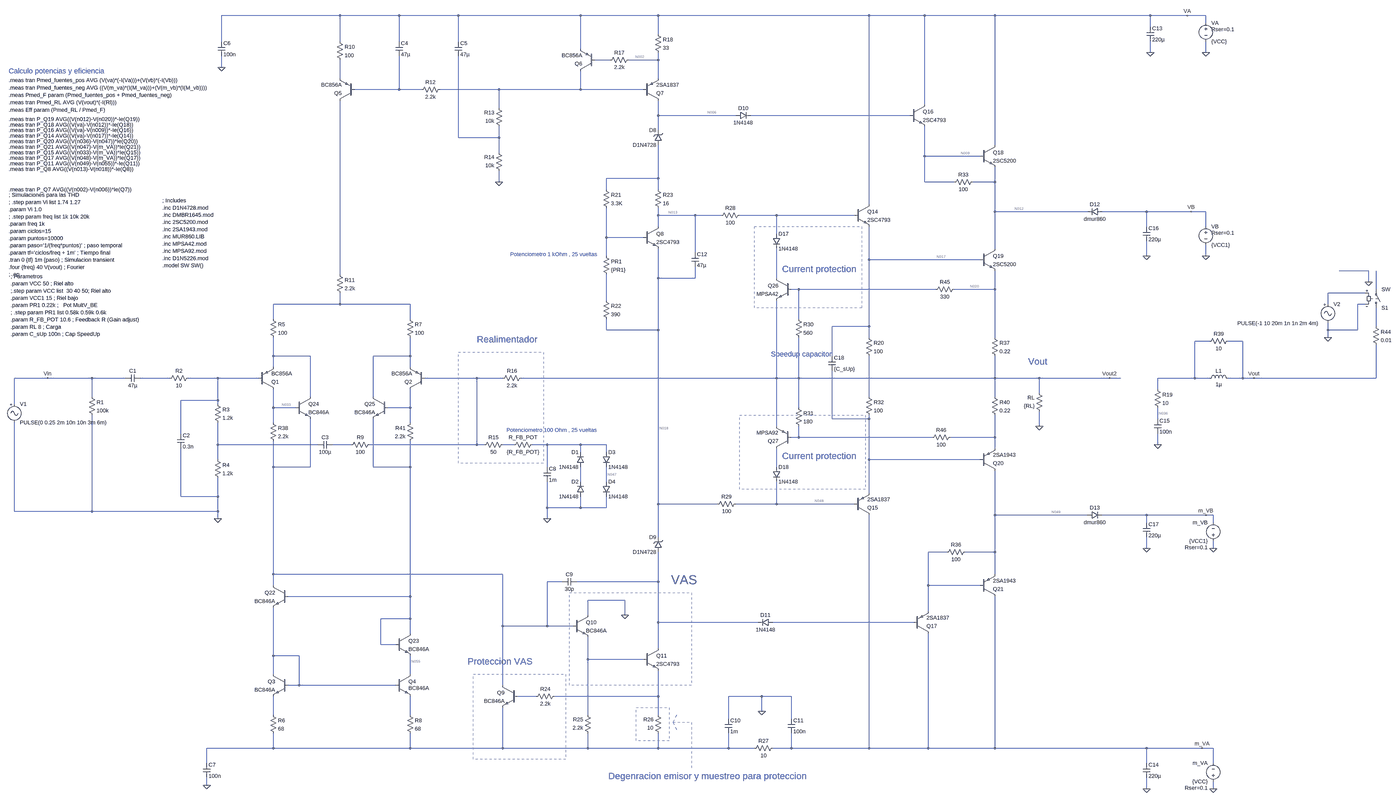
[diagram p0: schematic ClassG_v3_slewRate.asc, whole sheet]
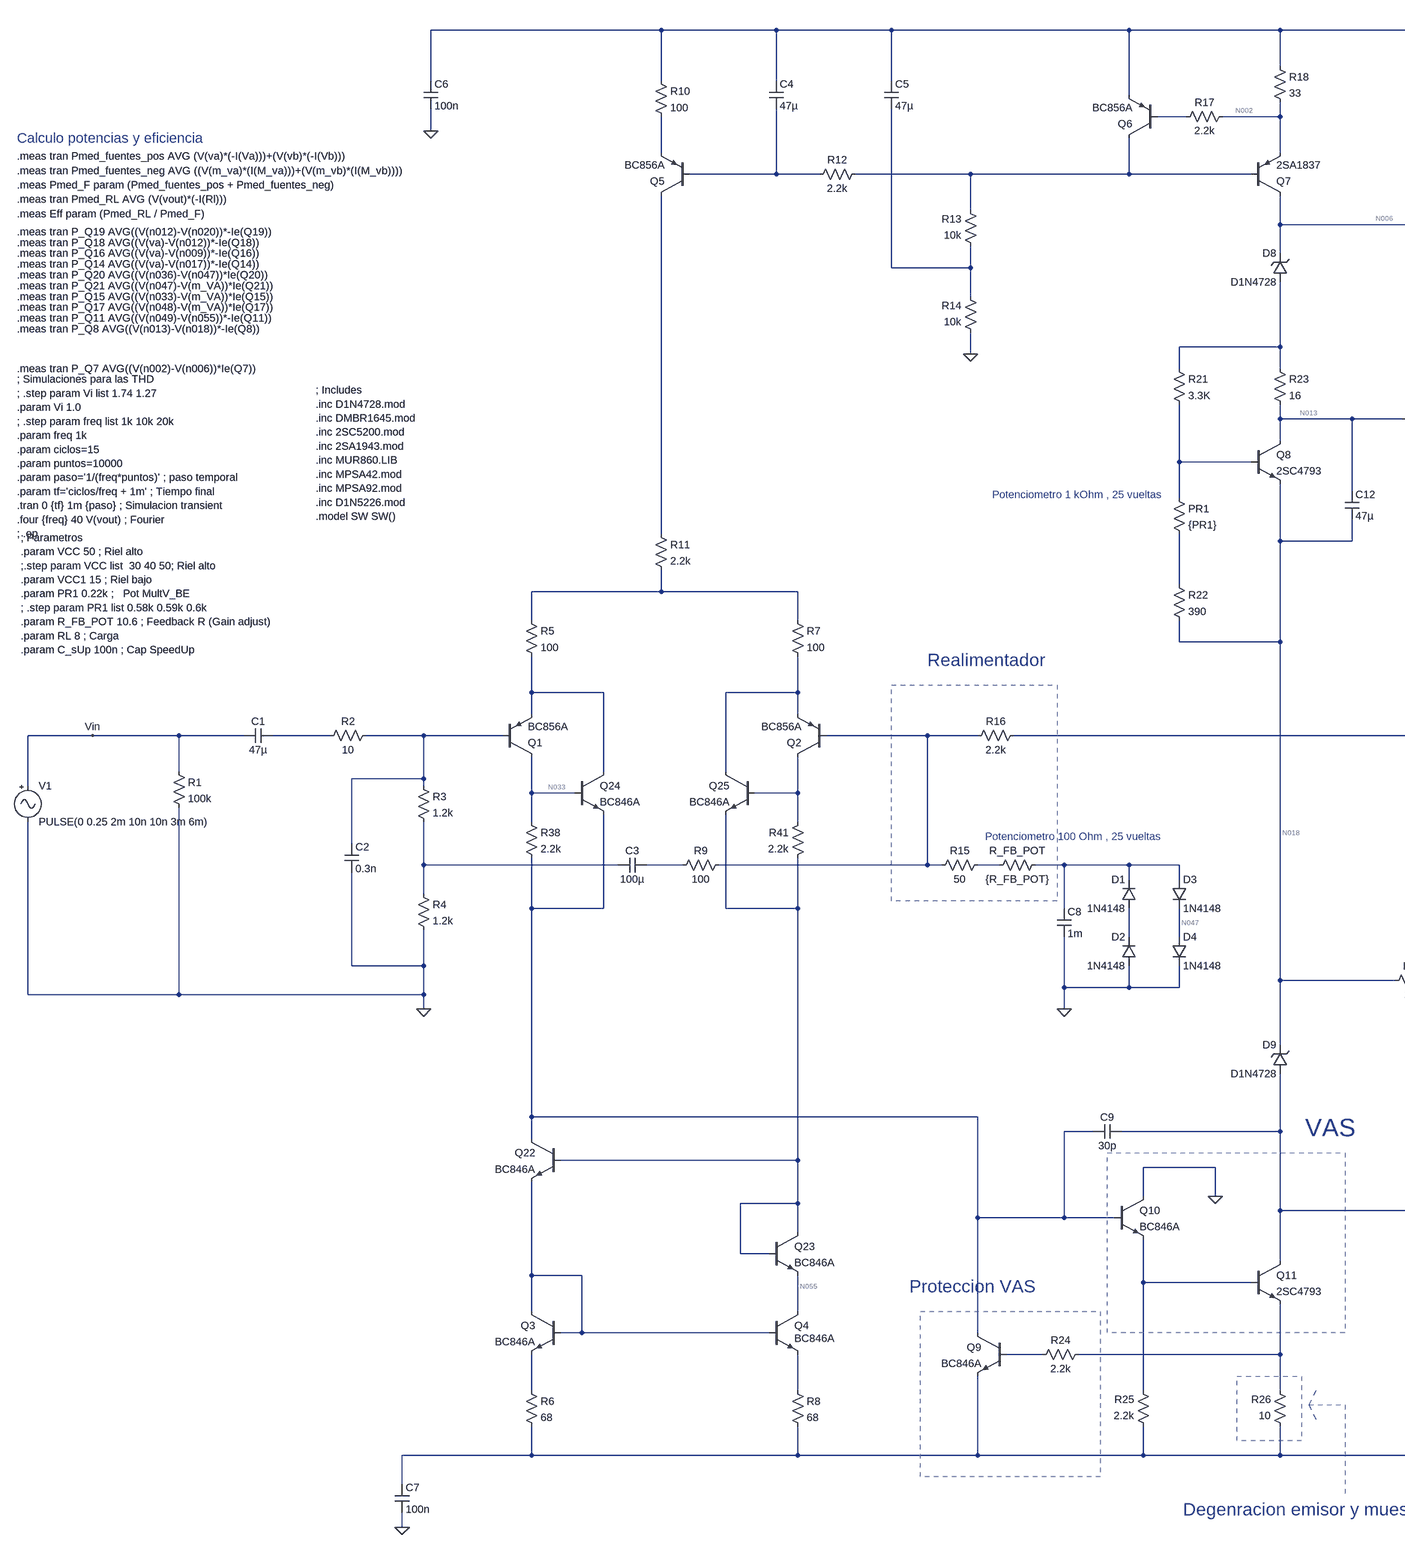
[diagram p1: schematic ClassG_v3_slewRate.asc, part, row 1 of 1, column 1 of 2]
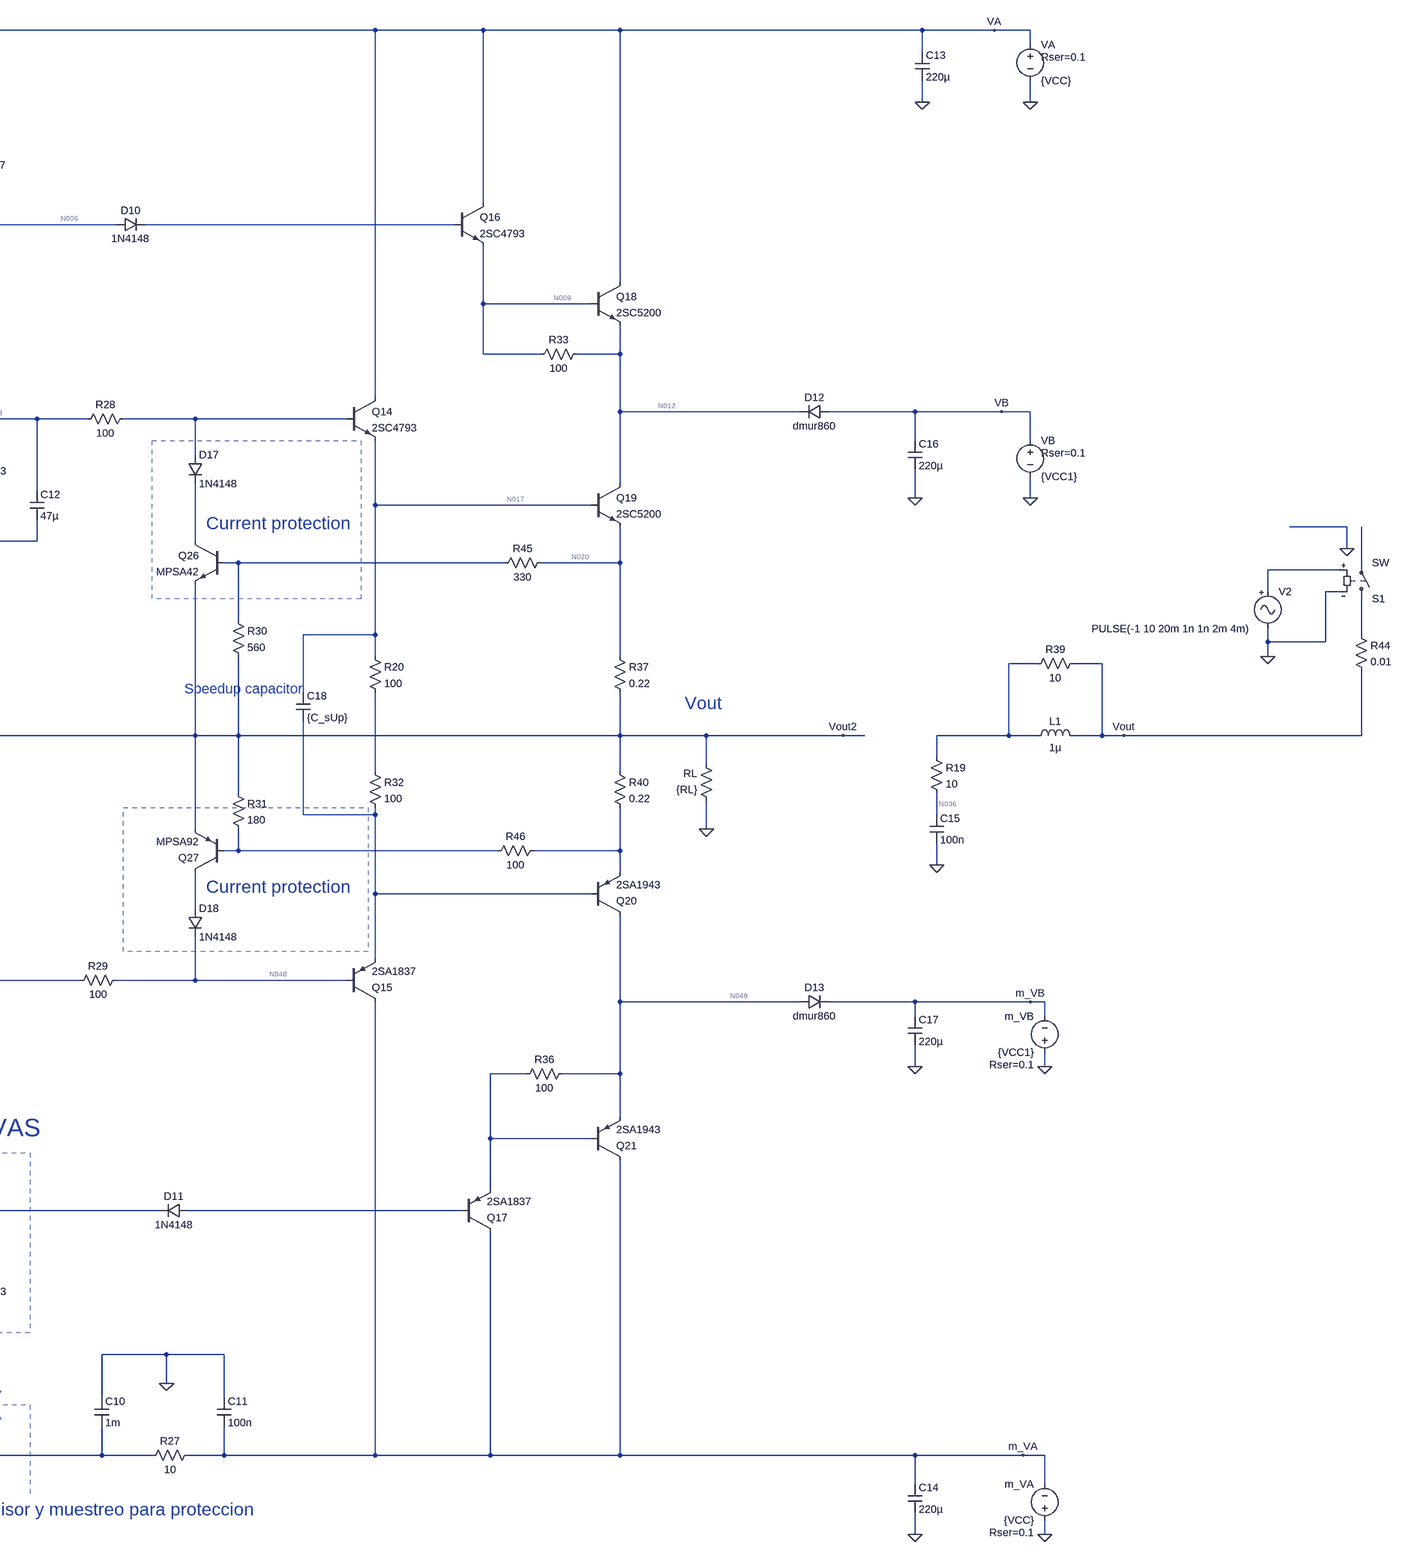
[diagram p2: schematic ClassG_v3_slewRate.asc, part, row 1 of 1, column 2 of 2]
ClassG_v3_slewRate.asc, the LTspice schematic file:
Version 4
SHEET 1 5612 1844
WIRE 1056 -1520 544 -1520
WIRE 1312 -1520 1056 -1520
WIRE 1568 -1520 1312 -1520
WIRE 2096 -1520 1568 -1520
WIRE 2432 -1520 2096 -1520
WIRE 3344 -1520 2432 -1520
WIRE 3584 -1520 3344 -1520
WIRE 3888 -1520 3584 -1520
WIRE 4560 -1520 3888 -1520
WIRE 4720 -1520 4560 -1520
WIRE 4800 -1520 4720 -1520
WIRE 4800 -1488 4800 -1520
WIRE 4560 -1472 4560 -1520
WIRE 2432 -1440 2432 -1520
WIRE 544 -1408 544 -1520
WIRE 1056 -1408 1056 -1520
WIRE 1312 -1408 1312 -1520
WIRE 1568 -1408 1568 -1520
WIRE 2096 -1376 2096 -1520
WIRE 4560 -1360 4560 -1408
WIRE 4800 -1360 4800 -1408
WIRE 2192 -1328 2160 -1328
WIRE 2224 -1328 2192 -1328
WIRE 2400 -1328 2304 -1328
WIRE 2432 -1328 2432 -1360
WIRE 2432 -1328 2400 -1328
WIRE 544 -1296 544 -1344
WIRE 1056 -1296 1056 -1328
WIRE 1056 -1248 1056 -1296
WIRE 2432 -1248 2432 -1328
WIRE 1216 -1200 1120 -1200
WIRE 1312 -1200 1312 -1344
WIRE 1312 -1200 1216 -1200
WIRE 1408 -1200 1312 -1200
WIRE 1744 -1200 1488 -1200
WIRE 1872 -1200 1744 -1200
WIRE 2096 -1200 2096 -1280
WIRE 2096 -1200 1872 -1200
WIRE 2368 -1200 2096 -1200
WIRE 3584 -1136 3584 -1520
WIRE 1744 -1120 1744 -1200
WIRE 2432 -1088 2432 -1152
WIRE 2560 -1088 2432 -1088
WIRE 2768 -1088 2560 -1088
WIRE 3024 -1088 2832 -1088
WIRE 3520 -1088 3024 -1088
WIRE 2432 -1024 2432 -1088
WIRE 1568 -992 1568 -1344
WIRE 1632 -992 1568 -992
WIRE 1744 -992 1744 -1040
WIRE 1744 -992 1632 -992
WIRE 3888 -960 3888 -1520
WIRE 1744 -928 1744 -992
WIRE 3584 -912 3584 -1040
WIRE 3696 -912 3584 -912
WIRE 3824 -912 3696 -912
WIRE 2432 -880 2432 -960
WIRE 1056 -864 1056 -1152
WIRE 2432 -816 2432 -880
WIRE 2432 -816 2208 -816
WIRE 1744 -800 1744 -848
WIRE 3584 -800 3584 -912
WIRE 3712 -800 3584 -800
WIRE 3888 -800 3888 -864
WIRE 3888 -800 3792 -800
WIRE 2208 -768 2208 -816
WIRE 2432 -768 2432 -816
WIRE 3344 -704 3344 -1520
WIRE 3888 -672 3888 -800
WIRE 4096 -672 3888 -672
WIRE 4288 -672 4096 -672
WIRE 4544 -672 4352 -672
WIRE 4736 -672 4544 -672
WIRE 4800 -672 4736 -672
WIRE 2432 -656 2432 -688
WIRE 2560 -656 2432 -656
WIRE 2592 -656 2560 -656
WIRE 2704 -656 2592 -656
WIRE 2944 -656 2784 -656
WIRE 3024 -656 2944 -656
WIRE 3280 -656 3024 -656
WIRE 2432 -608 2432 -656
WIRE 4544 -608 4544 -672
WIRE 4800 -608 4800 -672
WIRE 2944 -576 2944 -656
WIRE 2208 -560 2208 -688
WIRE 2288 -560 2208 -560
WIRE 2368 -560 2288 -560
WIRE 3888 -512 3888 -672
WIRE 2592 -496 2592 -656
WIRE 2208 -480 2208 -560
WIRE 4544 -480 4544 -544
WIRE 4800 -480 4800 -528
WIRE 2944 -464 2944 -512
WIRE 3344 -464 3344 -608
WIRE 3488 -464 3344 -464
WIRE 3824 -464 3488 -464
WIRE 5504 -416 5376 -416
WIRE 1056 -400 1056 -864
WIRE 2432 -384 2432 -512
WIRE 2592 -384 2592 -432
WIRE 2592 -384 2432 -384
WIRE 2944 -384 2944 -464
WIRE 5504 -368 5504 -416
WIRE 3040 -336 3008 -336
WIRE 3632 -336 3040 -336
WIRE 3888 -336 3888 -416
WIRE 3888 -336 3712 -336
WIRE 5536 -336 5536 -416
WIRE 5488 -320 5328 -320
WIRE 2208 -288 2208 -400
WIRE 1056 -272 1056 -320
WIRE 1056 -272 768 -272
WIRE 1200 -272 1056 -272
WIRE 1360 -272 1200 -272
WIRE 5328 -272 5328 -320
WIRE 5488 -272 5456 -272
WIRE 3888 -256 3888 -336
WIRE 768 -208 768 -272
WIRE 1360 -208 1360 -272
WIRE 3040 -208 3040 -336
WIRE 3344 -176 3344 -464
WIRE 3344 -176 3184 -176
WIRE 5536 -176 5536 -256
WIRE 2208 -160 2208 -208
WIRE 2432 -160 2432 -384
WIRE 2432 -160 2208 -160
WIRE 5328 -160 5328 -192
WIRE 5456 -160 5456 -272
WIRE 5456 -160 5328 -160
WIRE 3344 -128 3344 -176
WIRE 3888 -128 3888 -256
WIRE 5328 -128 5328 -160
WIRE 4816 -112 4752 -112
WIRE 4960 -112 4896 -112
WIRE 2432 -64 2432 -160
WIRE 768 -48 768 -128
WIRE 864 -48 768 -48
WIRE 928 -48 864 -48
WIRE 1280 -48 1200 -48
WIRE 1360 -48 1360 -128
WIRE 1360 -48 1280 -48
WIRE 3184 -48 3184 -176
WIRE 768 0 768 -48
WIRE 1360 0 1360 -48
WIRE 3344 0 3344 -48
WIRE -208 48 -352 48
WIRE -80 48 -208 48
WIRE -16 48 -80 48
WIRE 128 48 -16 48
WIRE 320 48 192 48
WIRE 528 48 400 48
WIRE 544 48 528 48
WIRE 704 48 544 48
WIRE 1648 48 1424 48
WIRE 1760 48 1648 48
WIRE 2944 48 2944 -288
WIRE 2944 48 1840 48
WIRE 3040 48 3040 -128
WIRE 3040 48 2944 48
WIRE 3888 48 3888 -48
WIRE 3888 48 3040 48
WIRE 4016 48 3888 48
WIRE 4064 48 4016 48
WIRE 4080 48 4064 48
WIRE 4384 48 4080 48
WIRE 4432 48 4384 48
WIRE 4752 48 4752 -112
WIRE 4752 48 4592 48
WIRE 4816 48 4752 48
WIRE 4960 48 4960 -112
WIRE 4960 48 4896 48
WIRE 5008 48 4960 48
WIRE 5536 48 5536 -96
WIRE 5536 48 5008 48
WIRE 4592 96 4592 48
WIRE 4080 112 4080 48
WIRE -16 128 -16 48
WIRE 928 128 928 -48
WIRE 1200 128 1200 -48
WIRE 3344 128 3344 0
WIRE 3888 128 3888 48
WIRE 528 144 528 48
WIRE 528 144 368 144
WIRE -352 160 -352 48
WIRE 528 160 528 144
WIRE 768 176 768 96
WIRE 784 176 768 176
WIRE 864 176 784 176
WIRE 1328 176 1264 176
WIRE 1360 176 1360 96
WIRE 1360 176 1328 176
WIRE 3040 176 3040 48
WIRE 3184 224 3184 16
WIRE 3344 224 3344 208
WIRE 3344 224 3184 224
WIRE 4592 224 4592 176
WIRE 768 240 768 176
WIRE 1360 240 1360 176
WIRE 2944 256 2944 48
WIRE 4080 256 4080 192
WIRE 368 288 368 144
WIRE 3040 304 3040 256
WIRE 3040 304 3008 304
WIRE 3616 304 3040 304
WIRE 3888 304 3888 208
WIRE 3888 304 3696 304
WIRE 528 336 528 240
WIRE 624 336 528 336
WIRE 960 336 624 336
WIRE 1104 336 1024 336
WIRE 1552 336 1184 336
WIRE 1648 336 1648 48
WIRE 1648 336 1552 336
WIRE 1680 336 1648 336
WIRE 1808 336 1760 336
WIRE 1952 336 1888 336
WIRE 2096 336 1952 336
WIRE 2208 336 2096 336
WIRE 4592 336 4592 288
WIRE 3888 352 3888 304
WIRE 2096 368 2096 336
WIRE 2208 368 2208 336
WIRE 2944 384 2944 352
WIRE 528 400 528 336
WIRE 3344 400 3344 224
WIRE 3472 400 3344 400
WIRE 3824 400 3472 400
WIRE 768 432 768 320
WIRE 928 432 928 224
WIRE 928 432 768 432
WIRE 1200 432 1200 224
WIRE 1360 432 1360 320
WIRE 1360 432 1200 432
WIRE 1952 432 1952 336
WIRE 2944 432 2944 384
WIRE 2096 496 2096 432
WIRE 2208 496 2208 432
WIRE 3344 544 3344 400
WIRE 368 560 368 352
WIRE 528 560 528 480
WIRE 528 560 368 560
WIRE 2432 592 2432 -64
WIRE 2688 592 2432 592
WIRE 2944 592 2944 496
WIRE 2944 592 2768 592
WIRE 2976 592 2944 592
WIRE 3280 592 2976 592
WIRE 1952 608 1952 496
WIRE 2096 608 2096 560
WIRE 2096 608 1952 608
WIRE 2208 608 2208 560
WIRE 2208 608 2096 608
WIRE -352 624 -352 240
WIRE -16 624 -16 208
WIRE -16 624 -352 624
WIRE 528 624 528 560
WIRE 528 624 -16 624
WIRE 3888 640 3888 448
WIRE 4016 640 3888 640
WIRE 4288 640 4016 640
WIRE 4544 640 4352 640
WIRE 4800 640 4544 640
WIRE 4832 640 4800 640
WIRE 528 656 528 624
WIRE 1952 656 1952 608
WIRE 4544 672 4544 640
WIRE 4832 672 4832 640
WIRE 2432 736 2432 592
WIRE 4544 784 4544 736
WIRE 4832 784 4832 752
WIRE 1360 800 1360 432
WIRE 3680 800 3600 800
WIRE 3888 800 3888 640
WIRE 3888 800 3760 800
WIRE 768 816 768 432
WIRE 768 896 768 816
WIRE 1760 896 768 896
WIRE 3888 896 3888 800
WIRE 2016 928 1952 928
WIRE 2432 928 2432 800
WIRE 2432 928 2080 928
WIRE 768 944 768 896
WIRE 3600 944 3600 800
WIRE 3680 944 3600 944
WIRE 3824 944 3680 944
WIRE 1360 992 1360 800
WIRE 1360 992 832 992
WIRE 2288 1008 2128 1008
WIRE 3600 1056 3600 944
WIRE 2128 1072 2128 1008
WIRE 2288 1072 2288 1008
WIRE 1360 1088 1360 992
WIRE 1360 1088 1232 1088
WIRE 2432 1104 2432 928
WIRE 2592 1104 2432 1104
WIRE 2864 1104 2592 1104
WIRE 3200 1104 2928 1104
WIRE 3536 1104 3200 1104
WIRE 1760 1120 1760 896
WIRE 1872 1120 1760 1120
WIRE 1952 1120 1952 928
WIRE 1952 1120 1872 1120
WIRE 2064 1120 1952 1120
WIRE 1360 1152 1360 1088
WIRE 1232 1200 1232 1088
WIRE 1296 1200 1232 1200
WIRE 2432 1216 2432 1104
WIRE 768 1232 768 1040
WIRE 768 1248 768 1232
WIRE 880 1248 768 1248
WIRE 2128 1264 2128 1168
WIRE 2208 1264 2128 1264
WIRE 2368 1264 2208 1264
WIRE 1360 1296 1360 1248
WIRE 768 1328 768 1248
WIRE 1360 1328 1360 1296
WIRE 880 1376 880 1248
WIRE 880 1376 832 1376
WIRE 1296 1376 880 1376
WIRE 1760 1376 1760 1120
WIRE 1856 1424 1824 1424
WIRE 1904 1424 1856 1424
WIRE 2256 1424 1984 1424
WIRE 2432 1424 2432 1312
WIRE 2432 1424 2256 1424
WIRE 2880 1424 2736 1424
WIRE 3008 1424 2880 1424
WIRE 768 1456 768 1424
WIRE 1360 1472 1360 1424
WIRE 2880 1488 2880 1424
WIRE 768 1504 768 1456
WIRE 1360 1504 1360 1472
WIRE 2128 1504 2128 1264
WIRE 2432 1504 2432 1424
WIRE 2736 1520 2736 1424
WIRE 3008 1520 3008 1424
WIRE 768 1648 768 1584
WIRE 768 1648 480 1648
WIRE 1360 1648 1360 1584
WIRE 1360 1648 768 1648
WIRE 1488 1648 1360 1648
WIRE 1760 1648 1760 1472
WIRE 1760 1648 1488 1648
WIRE 2128 1648 2128 1584
WIRE 2128 1648 1760 1648
WIRE 2432 1648 2432 1584
WIRE 2432 1648 2128 1648
WIRE 2736 1648 2736 1584
WIRE 2736 1648 2432 1648
WIRE 2848 1648 2736 1648
WIRE 3008 1648 3008 1584
WIRE 3008 1648 2928 1648
WIRE 3344 1648 3344 640
WIRE 3344 1648 3008 1648
WIRE 3600 1648 3600 1152
WIRE 3600 1648 3344 1648
WIRE 3888 1648 3888 992
WIRE 3888 1648 3600 1648
WIRE 4544 1648 3888 1648
WIRE 4784 1648 4544 1648
WIRE 4832 1648 4784 1648
WIRE 480 1712 480 1648
WIRE 4544 1712 4544 1648
WIRE 4832 1712 4832 1648
WIRE 480 1808 480 1776
WIRE 4544 1824 4544 1776
WIRE 4832 1824 4832 1792
FLAG 528 656 0
FLAG 1952 656 0
FLAG 2880 1488 0
FLAG 2288 1072 0
FLAG 4544 784 0
FLAG 4544 1824 0
FLAG 4832 1824 0
FLAG 4832 784 0
FLAG 1744 -800 0
FLAG 544 -1296 0
FLAG 4560 -1360 0
FLAG 4800 -1360 0
FLAG 4800 -480 0
FLAG 4544 -480 0
FLAG 4592 336 0
FLAG 4080 256 0
FLAG 480 1808 0
FLAG 5008 48 Vout
FLAG -208 48 Vin
FLAG 4384 48 Vout2
FLAG 5328 -128 0
FLAG 5504 -368 0
FLAG 4800 640 m_VB
FLAG 4736 -672 VB
FLAG 4720 -1520 VA
FLAG 4784 1648 m_VA
DATAFLAG 4016 48 ""
DATAFLAG 4064 48 ""
DATAFLAG 4016 640 ""
DATAFLAG 1552 336 ""
DATAFLAG 768 816 ""
DATAFLAG 1360 800 ""
DATAFLAG 544 48 ""
DATAFLAG 2256 1424 ""
DATAFLAG 2208 1264 ""
DATAFLAG 2432 -64 ""
DATAFLAG 2432 -880 ""
DATAFLAG 3024 -656 ""
DATAFLAG 3488 -464 ""
DATAFLAG 3472 400 ""
DATAFLAG 3680 944 ""
DATAFLAG 3696 -912 ""
DATAFLAG 1872 -1200 ""
DATAFLAG 1200 -272 ""
DATAFLAG 1056 -864 ""
DATAFLAG 624 336 ""
DATAFLAG -80 48 ""
DATAFLAG 2976 592 ""
DATAFLAG 3024 -1088 ""
DATAFLAG 2400 -1328 ""
DATAFLAG 1216 -1200 ""
DATAFLAG 1632 -992 ""
DATAFLAG 768 1232 ""
DATAFLAG 1856 1424 ""
DATAFLAG 1360 1296 ""
DATAFLAG 1328 176 ""
DATAFLAG 784 176 ""
DATAFLAG 864 -48 ""
DATAFLAG 1280 -48 ""
DATAFLAG 2944 -464 ""
DATAFLAG 3040 -336 ""
DATAFLAG 3040 304 ""
DATAFLAG 2944 384 ""
DATAFLAG 3888 -256 ""
DATAFLAG 3888 304 ""
DATAFLAG 2592 1104 ""
DATAFLAG 1360 1472 ""
DATAFLAG 768 1456 ""
DATAFLAG 3200 1104 ""
DATAFLAG 3344 0 ""
DATAFLAG 2288 -560 ""
DATAFLAG 2560 -656 ""
DATAFLAG 2560 -1088 ""
DATAFLAG 2192 -1328 ""
DATAFLAG 1056 -1296 ""
DATAFLAG 4096 -672 ""
DATAFLAG 1872 1120 ""
DATAFLAG 1488 1648 ""
SYMBOL res -32 112 R0
SYMATTR InstName R1
SYMATTR Value 100k
SYMBOL res 416 32 R90
WINDOW 0 0 56 VBottom 2
WINDOW 3 32 56 VTop 2
SYMATTR InstName R2
SYMATTR Value 10
SYMBOL cap 192 32 R90
WINDOW 0 0 32 VBottom 2
WINDOW 3 32 32 VTop 2
SYMATTR InstName C1
SYMATTR Value 47µ
SYMBOL res 512 144 R0
SYMATTR InstName R3
SYMATTR Value 1.2k
SYMBOL res 512 384 R0
SYMATTR InstName R4
SYMATTR Value 1.2k
SYMBOL cap 352 288 R0
SYMATTR InstName C2
SYMATTR Value 0.3n
SYMBOL res 752 -224 R0
SYMATTR InstName R5
SYMATTR Value 100
SYMBOL res 1344 -224 R0
SYMATTR InstName R7
SYMATTR Value 100
SYMBOL res 1040 -416 R0
SYMATTR InstName R11
SYMATTR Value 2.2k
SYMBOL res 1856 32 R90
WINDOW 0 0 56 VBottom 2
WINDOW 3 32 56 VTop 2
SYMATTR InstName R16
SYMATTR Value 2.2k
SYMBOL res 1200 320 R90
WINDOW 0 0 56 VBottom 2
WINDOW 3 32 56 VTop 2
SYMATTR InstName R9
SYMATTR Value 100
SYMBOL cap 1024 320 R90
WINDOW 0 0 32 VBottom 2
WINDOW 3 32 32 VTop 2
SYMATTR InstName C3
SYMATTR Value 100µ
SYMBOL res 1776 320 R90
WINDOW 0 0 56 VBottom 2
WINDOW 3 32 56 VTop 2
SYMATTR InstName R15
SYMATTR Value 50
SYMBOL cap 1936 432 R0
SYMATTR InstName C8
SYMATTR Value 1m
SYMBOL diode 2112 432 R180
WINDOW 0 24 64 Left 2
WINDOW 3 24 0 Left 2
SYMATTR InstName D1
SYMATTR Value 1N4148
SYMBOL diode 2192 368 R0
SYMATTR InstName D3
SYMATTR Value 1N4148
SYMBOL diode 2192 496 R0
SYMATTR InstName D4
SYMATTR Value 1N4148
SYMBOL diode 2112 560 R180
WINDOW 0 24 64 Left 2
WINDOW 3 24 0 Left 2
SYMATTR InstName D2
SYMATTR Value 1N4148
SYMBOL Misc\\signal -352 144 R0
WINDOW 123 0 0 Left 2
WINDOW 39 0 0 Left 2
SYMATTR InstName V1
SYMATTR Value PULSE(0 0.25 2m 10n 10n 3m 6m)
SYMBOL npn 832 1328 M0
SYMATTR InstName Q3
SYMATTR Value BC846A
SYMBOL npn 1296 1328 R0
WINDOW 3 56 60 Left 2
SYMATTR Value BC846A
SYMATTR InstName Q4
SYMBOL res 752 1488 R0
SYMATTR InstName R6
SYMATTR Value 68
SYMBOL res 1344 1488 R0
SYMATTR InstName R8
SYMATTR Value 68
SYMBOL npn 1824 1376 M0
SYMATTR InstName Q9
SYMATTR Value BC846A
SYMBOL npn 2064 1072 R0
SYMATTR InstName Q10
SYMATTR Value BC846A
SYMBOL npn 2368 1216 R0
SYMATTR InstName Q11
SYMATTR Value 2SC4793
SYMBOL res 2000 1408 R90
WINDOW 0 0 56 VBottom 2
WINDOW 3 32 56 VTop 2
SYMATTR InstName R24
SYMATTR Value 2.2k
SYMBOL res 2144 1600 R180
WINDOW 0 36 76 Left 2
WINDOW 3 36 40 Left 2
SYMATTR InstName R25
SYMATTR Value 2.2k
SYMBOL res 2448 1600 R180
WINDOW 0 36 76 Left 2
WINDOW 3 36 40 Left 2
SYMATTR InstName R26
SYMATTR Value 10
SYMBOL cap 2080 912 R90
WINDOW 0 0 32 VBottom 2
WINDOW 3 32 32 VTop 2
SYMATTR InstName C9
SYMATTR Value 30p
SYMBOL cap 2720 1520 R0
SYMATTR InstName C10
SYMATTR Value 1m
SYMBOL cap 2992 1520 R0
SYMATTR InstName C11
SYMATTR Value 100n
SYMBOL res 2944 1632 R90
WINDOW 0 0 56 VBottom 2
WINDOW 3 32 56 VTop 2
SYMATTR InstName R27
SYMATTR Value 10
SYMBOL res 2784 576 R90
WINDOW 0 0 56 VBottom 2
WINDOW 3 32 56 VTop 2
SYMATTR InstName R29
SYMATTR Value 100
SYMBOL pnp 3280 640 M180
SYMATTR InstName Q15
SYMATTR Value 2SA1837
SYMBOL pnp 3824 448 M180
SYMATTR InstName Q20
SYMATTR Value 2SA1943
SYMBOL res 3872 112 R0
SYMATTR InstName R40
SYMATTR Value 0.22
SYMBOL res 3328 112 R0
SYMATTR InstName R32
SYMATTR Value 100
SYMBOL zener 2448 800 R180
WINDOW 0 24 64 Left 2
WINDOW 3 24 0 Left 2
SYMATTR InstName D9
SYMATTR Value D1N4728
SYMBOL pnp 3824 992 M180
SYMATTR InstName Q21
SYMATTR Value 2SA1943
SYMBOL pnp 3536 1152 M180
SYMATTR InstName Q17
SYMATTR Value 2SA1837
SYMBOL res 3776 784 R90
WINDOW 0 0 56 VBottom 2
WINDOW 3 32 56 VTop 2
SYMATTR InstName R36
SYMATTR Value 100
SYMBOL diode 2928 1088 R90
WINDOW 0 0 32 VBottom 2
WINDOW 3 32 32 VTop 2
SYMATTR InstName D11
SYMATTR Value 1N4148
SYMBOL diode 4288 656 R270
WINDOW 0 32 32 VTop 2
WINDOW 3 0 32 VBottom 2
SYMATTR InstName D13
SYMATTR Value dmur860
SYMBOL cap 4528 672 R0
SYMATTR InstName C17
SYMATTR Value 220µ
SYMBOL cap 4528 1712 R0
SYMATTR InstName C14
SYMATTR Value 220µ
SYMBOL voltage 4832 768 R180
WINDOW 0 24 96 Left 2
WINDOW 3 24 16 Left 2
WINDOW 123 0 0 Left 2
WINDOW 39 24 -12 Left 2
SYMATTR InstName m_VB
SYMATTR Value {VCC1}
SYMATTR SpiceLine Rser=0.1
SYMBOL voltage 4832 1808 R180
WINDOW 0 24 96 Left 2
WINDOW 3 24 16 Left 2
WINDOW 123 0 0 Left 2
WINDOW 39 24 -12 Left 2
SYMATTR InstName m_VA
SYMATTR Value {VCC}
SYMATTR SpiceLine Rser=0.1
SYMBOL pnp 1120 -1152 R180
SYMATTR InstName Q5
SYMATTR Value BC856A
SYMBOL res 1040 -1424 R0
SYMATTR InstName R10
SYMATTR Value 100
SYMBOL cap 528 -1408 R0
SYMATTR InstName C6
SYMATTR Value 100n
SYMBOL cap 1296 -1408 R0
SYMATTR InstName C4
SYMATTR Value 47µ
SYMBOL cap 1552 -1408 R0
SYMATTR InstName C5
SYMATTR Value 47µ
SYMBOL res 1504 -1216 R90
WINDOW 0 0 56 VBottom 2
WINDOW 3 32 56 VTop 2
SYMATTR InstName R12
SYMATTR Value 2.2k
SYMBOL res 1760 -1024 R180
WINDOW 0 36 76 Left 2
WINDOW 3 36 40 Left 2
SYMATTR InstName R13
SYMATTR Value 10k
SYMBOL res 1760 -832 R180
WINDOW 0 36 76 Left 2
WINDOW 3 36 40 Left 2
SYMATTR InstName R14
SYMATTR Value 10k
SYMBOL pnp 2160 -1280 R180
SYMATTR InstName Q6
SYMATTR Value BC856A
SYMBOL pnp 2368 -1152 M180
SYMATTR InstName Q7
SYMATTR Value 2SA1837
SYMBOL res 2416 -1456 R0
SYMATTR InstName R18
SYMATTR Value 33
SYMBOL res 2320 -1344 R90
WINDOW 0 0 56 VBottom 2
WINDOW 3 32 56 VTop 2
SYMATTR InstName R17
SYMATTR Value 2.2k
SYMBOL zener 2448 -960 R180
WINDOW 0 24 64 Left 2
WINDOW 3 24 0 Left 2
SYMATTR InstName D8
SYMATTR Value D1N4728
SYMBOL res 2416 -784 R0
SYMATTR InstName R23
SYMATTR Value 16
SYMBOL res 2192 -784 R0
SYMATTR InstName R21
SYMATTR Value 3.3K
SYMBOL res 2192 -496 R0
SYMATTR InstName PR1
SYMATTR Value {PR1}
SYMBOL res 2192 -304 R0
SYMATTR InstName R22
SYMATTR Value 390
SYMBOL npn 2368 -608 R0
SYMATTR InstName Q8
SYMATTR Value 2SC4793
SYMBOL cap 2576 -496 R0
SYMATTR InstName C12
SYMATTR Value 47µ
SYMBOL res 3328 -144 R0
SYMATTR InstName R20
SYMATTR Value 100
SYMBOL res 3872 -144 R0
SYMATTR InstName R37
SYMATTR Value 0.22
SYMBOL res 2800 -672 R90
WINDOW 0 0 56 VBottom 2
WINDOW 3 32 56 VTop 2
SYMATTR InstName R28
SYMATTR Value 100
SYMBOL npn 3280 -704 R0
SYMATTR InstName Q14
SYMATTR Value 2SC4793
SYMBOL npn 3824 -512 R0
SYMATTR InstName Q19
SYMATTR Value 2SC5200
SYMBOL npn 3520 -1136 R0
SYMATTR InstName Q16
SYMATTR Value 2SC4793
SYMBOL npn 3824 -960 R0
SYMATTR InstName Q18
SYMATTR Value 2SC5200
SYMBOL diode 2768 -1072 R270
WINDOW 0 32 32 VTop 2
WINDOW 3 0 32 VBottom 2
SYMATTR InstName D10
SYMATTR Value 1N4148
SYMBOL res 3808 -816 R90
WINDOW 0 0 56 VBottom 2
WINDOW 3 32 56 VTop 2
SYMATTR InstName R33
SYMATTR Value 100
SYMBOL diode 4352 -688 R90
WINDOW 0 0 32 VBottom 2
WINDOW 3 32 32 VTop 2
SYMATTR InstName D12
SYMATTR Value dmur860
SYMBOL cap 4528 -608 R0
SYMATTR InstName C16
SYMATTR Value 220µ
SYMBOL voltage 4800 -624 R0
WINDOW 123 0 0 Left 2
WINDOW 39 24 44 Left 2
SYMATTR SpiceLine Rser=0.1
SYMATTR InstName VB
SYMATTR Value {VCC1}
SYMBOL voltage 4800 -1504 R0
WINDOW 123 0 0 Left 2
WINDOW 39 24 44 Left 2
SYMATTR SpiceLine Rser=0.1
SYMATTR InstName VA
SYMATTR Value {VCC}
SYMBOL cap 4544 -1472 R0
SYMATTR InstName C13
SYMATTR Value 220µ
SYMBOL res 4576 80 R0
SYMATTR InstName R19
SYMATTR Value 10
SYMBOL cap 4576 224 R0
SYMATTR InstName C15
SYMATTR Value 100n
SYMBOL ind 4800 64 R270
WINDOW 0 32 56 VTop 2
WINDOW 3 5 56 VBottom 2
SYMATTR InstName L1
SYMATTR Value 1µ
SYMBOL res 4912 -128 R90
WINDOW 0 0 56 VBottom 2
WINDOW 3 32 56 VTop 2
SYMATTR InstName R39
SYMATTR Value 10
SYMBOL res 4096 208 R180
WINDOW 0 36 76 Left 2
WINDOW 3 36 40 Left 2
SYMATTR InstName RL
SYMATTR Value {RL}
SYMBOL cap 464 1712 R0
SYMATTR InstName C7
SYMATTR Value 100n
SYMBOL npn 832 944 M0
SYMATTR InstName Q22
SYMATTR Value BC846A
SYMBOL npn 1296 1152 R0
SYMATTR InstName Q23
SYMATTR Value BC846A
SYMBOL pnp 704 96 M180
SYMATTR InstName Q1
SYMATTR Value BC856A
SYMBOL res 752 224 R0
SYMATTR InstName R38
SYMATTR Value 2.2k
SYMBOL pnp 1424 96 R180
SYMATTR InstName Q2
SYMATTR Value BC856A
SYMBOL res 1376 224 M0
SYMATTR InstName R41
SYMATTR Value 2.2k
SYMBOL npn 864 128 R0
SYMATTR InstName Q24
SYMATTR Value BC846A
SYMBOL npn 1264 128 M0
SYMATTR InstName Q25
SYMATTR Value BC846A
SYMBOL cap 3168 -48 R0
SYMATTR InstName C18
SYMATTR Value {C_sUp}
SYMBOL Misc\\signal 5328 -288 R0
WINDOW 3 -392 99 Left 2
WINDOW 123 0 0 Left 2
WINDOW 39 0 0 Left 2
SYMATTR Value PULSE(-1 10 20m 1n 1n 2m 4m)
SYMATTR InstName V2
SYMBOL sw 5536 -240 M180
SYMATTR InstName S1
SYMBOL res 5520 -192 R0
SYMATTR InstName R44
SYMATTR Value 0.01
SYMBOL npn 3008 -384 M0
SYMATTR InstName Q26
SYMATTR Value MPSA42
SYMBOL diode 2928 -576 R0
SYMATTR InstName D17
SYMATTR Value 1N4148
SYMBOL res 3728 -352 R90
WINDOW 0 0 56 VBottom 2
WINDOW 3 32 56 VTop 2
SYMATTR InstName R45
SYMATTR Value 330
SYMBOL pnp 3008 352 R180
SYMATTR InstName Q27
SYMATTR Value MPSA92
SYMBOL diode 2928 432 R0
SYMATTR InstName D18
SYMATTR Value 1N4148
SYMBOL res 3712 288 R90
WINDOW 0 0 56 VBottom 2
WINDOW 3 32 56 VTop 2
SYMATTR InstName R46
SYMATTR Value 100
SYMBOL res 3024 -224 R0
SYMATTR InstName R30
SYMATTR Value 560
SYMBOL res 3024 160 R0
SYMATTR InstName R31
SYMATTR Value 180
SYMBOL res 1904 320 R90
WINDOW 0 0 56 VBottom 2
WINDOW 3 32 56 VTop 2
SYMATTR InstName R_FB_POT
SYMATTR Value {R_FB_POT}
TEXT 1608 1272 Left 4 ;Proteccion VAS
TEXT 2216 1768 Left 4 ;Degenracion emisor y muestreo para proteccion
TEXT 2488 920 Left 5 ;VAS
TEXT 2920 -56 Left 3 ;Speedup capacitor
TEXT 2968 -424 Left 4 ;Current protection
TEXT 2968 384 Left 4 ;Current protection
TEXT 4032 -24 Left 4 ;Vout
TEXT -376 -1208 Left 2 !.meas tran Pmed_fuentes_neg AVG ((V(m_va)*(I(M_va)))+(V(m_vb)*(I(M_vb))))
TEXT -376 -1240 Left 2 !.meas tran Pmed_fuentes_pos AVG (V(va)*(-I(Va)))+(V(vb)*(-I(Vb)))
TEXT -376 -1176 Left 2 !.meas Pmed_F param (Pmed_fuentes_pos + Pmed_fuentes_neg)
TEXT -376 -1280 Left 3 ;Calculo potencias y eficiencia
TEXT -376 -1144 Left 2 !.meas tran Pmed_RL AVG (V(vout)*(-I(Rl)))
TEXT -376 -1112 Left 2 !.meas Eff param (Pmed_RL / Pmed_F)
TEXT -376 -744 Left 2 !; Simulaciones para las THD \n; .step param Vi list 1.74 1.27\n.param Vi 1.0\n; .step param freq list 1k 10k 20k\n.param freq 1k\n.param ciclos=15\n.param puntos=10000\n.param paso='1/(freq*puntos)' ; paso temporal\n.param tf='ciclos/freq + 1m' ; Tiempo final\n.tran 0 {tf} 1m {paso} ; Simulacion transient\n.four {freq} 40 V(vout) ; Fourier\n; .op
TEXT -368 -392 Left 2 !; Parametros\n.param VCC 50 ; Riel alto\n;.step param VCC list  30 40 50; Riel alto\n.param VCC1 15 ; Riel bajo\n.param PR1 0.22k ;   Pot MultV_BE\n; .step param PR1 list 0.58k 0.59k 0.6k\n.param R_FB_POT 10.6 ; Feedback R (Gain adjust)\n.param RL 8 ; Carga\n.param C_sUp 100n ; Cap SpeedUp
TEXT 288 -720 Left 2 !; Includes \n.inc D1N4728.mod\n.inc DMBR1645.mod\n.inc 2SC5200.mod\n.inc 2SA1943.mod\n.inc MUR860.LIB\n.inc MPSA42.mod\n.inc MPSA92.mod\n.inc D1N5226.mod\n.model SW SW()
TEXT 1776 272 Left 2 ;Potenciometro 100 Ohm , 25 vueltas
TEXT 1792 -488 Left 2 ;Potenciometro 1 kOhm , 25 vueltas
TEXT -376 -1072 Left 2 !.meas tran P_Q19 AVG((V(n012)-V(n020))*-Ie(Q19))
TEXT -376 -1048 Left 2 !.meas tran P_Q18 AVG((V(va)-V(n012))*-Ie(Q18))
TEXT -376 -1024 Left 2 !.meas tran P_Q16 AVG((V(va)-V(n009))*-Ie(Q16))
TEXT -376 -1000 Left 2 !.meas tran P_Q14 AVG((V(va)-V(n017))*-Ie(Q14))
TEXT -376 -976 Left 2 !.meas tran P_Q20 AVG((V(n036)-V(n047))*Ie(Q20))
TEXT -376 -952 Left 2 !.meas tran P_Q21 AVG((V(n047)-V(m_VA))*Ie(Q21))
TEXT -376 -928 Left 2 !.meas tran P_Q15 AVG((V(n033)-V(m_VA))*Ie(Q15))
TEXT -376 -904 Left 2 !.meas tran P_Q17 AVG((V(n048)-V(m_VA))*Ie(Q17))
TEXT -376 -768 Left 2 !.meas tran P_Q7 AVG((V(n002)-V(n006))*Ie(Q7))
TEXT -376 -880 Left 2 !.meas tran P_Q11 AVG((V(n049)-V(n055))*-Ie(Q11))
TEXT -376 -856 Left 2 !.meas tran P_Q8 AVG((V(n013)-V(n018))*-Ie(Q8))
TEXT 1648 -120 Left 4 ;Realimentador
LINE Normal 2576 1536 2576 1744 2
LINE Normal 2496 1536 2576 1536 2
LINE Normal 2512 1504 2496 1536 2
LINE Normal 2496 1536 2512 1504 2
LINE Normal 2512 1568 2496 1536 2
LINE Normal 2496 1536 2512 1568 2
RECTANGLE Normal 2032 1696 1632 1328 2
RECTANGLE Normal 2480 1616 2336 1472 2
RECTANGLE Normal 2576 1376 2048 976 2
RECTANGLE Normal 3312 -256 2848 -608 2
RECTANGLE Normal 3328 528 2784 208 2
RECTANGLE Normal 1936 416 1568 -64 2

The netlist it stands for:
* ClassG_v3_slewRate.asc
R1 Vin 0 100k
R2 N031 N030 10
C1 N030 Vin 47µ
R3 N031 N039 1.2k
R4 N039 0 1.2k
C2 N031 0 0.3n
R5 N024 N027 100
R7 N024 N028 100
R11 N011 N024 2.2k
R16 Vout2 N032 2.2k
R9 N032 N040 100
C3 N040 N039 100µ
R15 N041 N032 50
C8 N042 0 1m
D1 N046 N042 1N4148
D3 N042 N047 1N4148
D4 N047 0 1N4148
D2 0 N046 1N4148
V1 Vin 0 PULSE(0 0.25 2m 10n 10n 3m 6m)
Q3 N053 N053 N058 0 BC846A
Q4 N055 N053 N059 0 BC846A
R6 N058 N060 68
R8 N059 N060 68
Q9 N044 N056 N060 0 BC846A
Q10 0 N044 N054 0 BC846A
Q11 N051 N054 N057 0 2SC4793
R24 N057 N056 2.2k
R25 N060 N054 2.2k
R26 N060 N057 10
C9 N051 N044 30p
C10 0 N060 1m
C11 0 m_VA 100n
R27 m_VA N060 10
R29 N048 N018 100
Q15 m_VA N048 N035 0 2SA1837
Q20 N049 N035 N038 0 2SA1943
R40 Vout2 N038 0.22
R32 N029 N035 100
D9 N051 N018 D1N4728
Q21 m_VA N050 N049 0 2SA1943
Q17 m_VA N052 N050 0 2SA1837
R36 N049 N050 100
D11 N052 N051 1N4148
D13 N049 m_VB dmur860
C17 m_VB 0 220µ
C14 m_VA 0 220µ
V§m_VB 0 m_VB {VCC1} Rser=0.1
V§m_VA 0 m_VA {VCC} Rser=0.1
Q5 N011 N004 N003 0 BC856A
R10 VA N003 100
C6 VA 0 100n
C4 VA N004 47µ
C5 VA N008 47µ
R12 N005 N004 2.2k
R13 N008 N005 10k
R14 0 N008 10k
Q6 N005 N001 VA 0 BC856A
Q7 N006 N005 N002 0 2SA1837
R18 VA N002 33
R17 N002 N001 2.2k
D8 N010 N006 D1N4728
R23 N010 N013 16
R21 N010 N015 3.3K
R§PR1 N015 N023 {PR1}
R22 N023 N018 390
Q8 N013 N015 N018 0 2SC4793
C12 N013 N018 47µ
R20 N017 N029 100
R37 N020 Vout2 0.22
R28 N014 N013 100
Q14 VA N014 N017 0 2SC4793
Q19 N012 N017 N020 0 2SC5200
Q16 VA N007 N009 0 2SC4793
Q18 VA N009 N012 0 2SC5200
D10 N006 N007 1N4148
R33 N012 N009 100
D12 VB N012 dmur860
C16 VB 0 220µ
VB VB 0 {VCC1} Rser=0.1
VA VA 0 {VCC} Rser=0.1
C13 VA 0 220µ
R19 N026 N036 10
C15 N036 0 100n
L1 N026 Vout 1µ
R39 Vout N026 10
RL 0 Vout2 {RL}
C7 N060 0 100n
Q22 N044 N045 N053 0 BC846A
Q23 N045 N045 N055 0 BC846A
Q1 N033 N031 N027 0 BC856A
R38 N033 N044 2.2k
Q2 N034 N032 N028 0 BC856A
R41 N034 N045 2.2k
Q24 N027 N033 N044 0 BC846A
Q25 N028 N034 N045 0 BC846A
C18 N017 N035 {C_sUp}
V2 N022 0 PULSE(-1 10 20m 1n 1n 2m 4m)
S1 N025 N021 N022 0 SW
R44 N025 Vout 0.01
Q26 N016 N019 Vout2 0 MPSA42
D17 N014 N016 1N4148
R45 N020 N019 330
Q27 N043 N037 Vout2 0 MPSA92
D18 N043 N048 1N4148
R46 N038 N037 100
R30 N019 Vout2 560
R31 Vout2 N037 180
R_FB_POT N042 N041 {R_FB_POT}
.model D D
.lib standard.dio
.model NPN NPN
.model PNP PNP
.lib standard.bjt
* Proteccion VAS
* Degenracion emisor y muestreo para proteccion
* VAS
* Speedup capacitor
* Current protection
* Current protection
* Vout
.meas tran Pmed_fuentes_neg AVG ((V(m_va)*(I(M_va)))+(V(m_vb)*(I(M_vb))))
.meas tran Pmed_fuentes_pos AVG (V(va)*(-I(Va)))+(V(vb)*(-I(Vb)))
.meas Pmed_F param (Pmed_fuentes_pos + Pmed_fuentes_neg)
* Calculo potencias y eficiencia
.meas tran Pmed_RL AVG (V(vout)*(-I(Rl)))
.meas Eff param (Pmed_RL / Pmed_F)
; Simulaciones para las THD
; .step param Vi list 1.74 1.27
.param Vi 1.0
; .step param freq list 1k 10k 20k
.param freq 1k
.param ciclos=15
.param puntos=10000
.param paso='1/(freq*puntos)' ; paso temporal
.param tf='ciclos/freq + 1m' ; Tiempo final
.tran 0 {tf} 1m {paso} ; Simulacion transient
.four {freq} 40 V(vout) ; Fourier
; .op
; Parametros
.param VCC 50 ; Riel alto
;.step param VCC list  30 40 50; Riel alto
.param VCC1 15 ; Riel bajo
.param PR1 0.22k ;   Pot MultV_BE
; .step param PR1 list 0.58k 0.59k 0.6k
.param R_FB_POT 10.6 ; Feedback R (Gain adjust)
.param RL 8 ; Carga
.param C_sUp 100n ; Cap SpeedUp
; Includes
.inc D1N4728.mod
.inc DMBR1645.mod
.inc 2SC5200.mod
.inc 2SA1943.mod
.inc MUR860.LIB
.inc MPSA42.mod
.inc MPSA92.mod
.inc D1N5226.mod
.model SW SW()
* Potenciometro 100 Ohm , 25 vueltas
* Potenciometro 1 kOhm , 25 vueltas
.meas tran P_Q19 AVG((V(n012)-V(n020))*-Ie(Q19))
.meas tran P_Q18 AVG((V(va)-V(n012))*-Ie(Q18))
.meas tran P_Q16 AVG((V(va)-V(n009))*-Ie(Q16))
.meas tran P_Q14 AVG((V(va)-V(n017))*-Ie(Q14))
.meas tran P_Q20 AVG((V(n036)-V(n047))*Ie(Q20))
.meas tran P_Q21 AVG((V(n047)-V(m_VA))*Ie(Q21))
.meas tran P_Q15 AVG((V(n033)-V(m_VA))*Ie(Q15))
.meas tran P_Q17 AVG((V(n048)-V(m_VA))*Ie(Q17))
.meas tran P_Q7 AVG((V(n002)-V(n006))*Ie(Q7))
.meas tran P_Q11 AVG((V(n049)-V(n055))*-Ie(Q11))
.meas tran P_Q8 AVG((V(n013)-V(n018))*-Ie(Q8))
* Realimentador
.backanno
.end